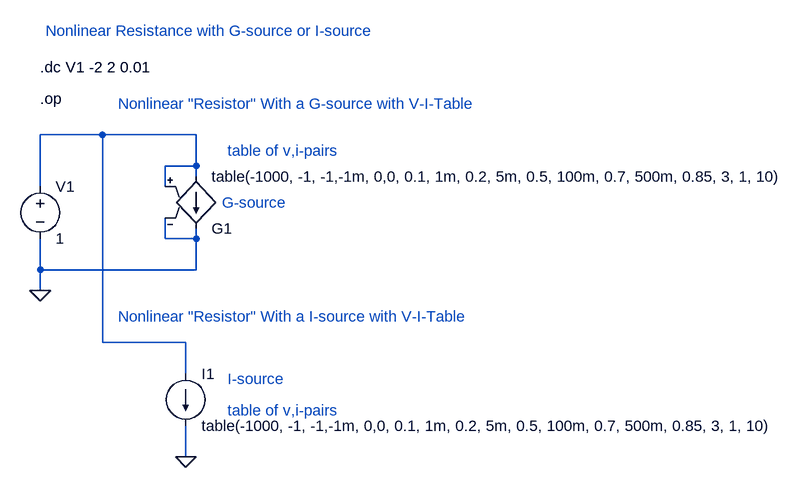
[diagram p0: schematic Nonlinear_resistor_v_i.asc]
Nonlinear_resistor_v_i.asc, the LTspice schematic file:
Version 4
SHEET 1 1448 680
WIRE 96 32 0 32
WIRE 240 32 96 32
WIRE 240 80 240 32
WIRE 240 80 192 80
WIRE 240 96 240 80
WIRE 0 112 0 32
WIRE 192 112 192 80
WIRE 192 192 192 160
WIRE 240 192 240 176
WIRE 240 192 192 192
WIRE 0 240 0 192
WIRE 240 240 240 192
WIRE 240 240 0 240
WIRE 0 272 0 240
WIRE 96 352 96 32
WIRE 224 352 96 352
WIRE 224 400 224 352
WIRE 224 528 224 480
FLAG 0 272 0
FLAG 224 528 0
SYMBOL voltage 0 96 R0
SYMATTR InstName V1
SYMATTR Value 1
SYMBOL g2 240 192 M180
SYMATTR InstName G1
SYMATTR Value table(-1000, -1, -1,-1m, 0,0, 0.1, 1m, 0.2, 5m, 0.5, 100m, 0.7, 500m, 0.85, 3, 1, 10)
SYMBOL current 224 400 R0
WINDOW 123 0 0 Left 0
WINDOW 39 0 0 Left 0
SYMATTR InstName I1
SYMATTR Value table(-1000, -1, -1,-1m, 0,0, 0.1, 1m, 0.2, 5m, 0.5, 100m, 0.7, 500m, 0.85, 3, 1, 10)
TEXT 0 -24 Left 0 !.op
TEXT 0 -72 Left 0 !.dc V1 -2 2 0.01
TEXT 288 56 Left 0 ;table of v,i-pairs
TEXT 120 -16 Left 0 ;Nonlinear "Resistor" With a G-source with V-I-Table
TEXT 120 312 Left 0 ;Nonlinear "Resistor" With a I-source with V-I-Table
TEXT 288 456 Left 0 ;table of v,i-pairs
TEXT 280 136 Left 0 ;G-source
TEXT 288 408 Left 0 ;I-source
TEXT 8 -128 Left 0 ;Nonlinear Resistance with G-source or I-source

The netlist it stands for:
* Nonlinear_resistor_v_i.asc
V1 N001 0 1
G1 N001 0 N001 0 table(-1000, -1, -1,-1m, 0,0, 0.1, 1m, 0.2, 5m, 0.5, 100m, 0.7, 500m, 0.85, 3, 1, 10)
I1 N001 0 table(-1000, -1, -1,-1m, 0,0, 0.1, 1m, 0.2, 5m, 0.5, 100m, 0.7, 500m, 0.85, 3, 1, 10)
.op
.dc V1 -2 2 0.01
* table of v,i-pairs
* Nonlinear "Resistor" With a G-source with V-I-Table
* Nonlinear "Resistor" With a I-source with V-I-Table
* table of v,i-pairs
* G-source
* I-source
* Nonlinear Resistance with G-source or I-source
.backanno
.end